# EAGLE schematic Balanbot-v2.0 (EAGLE 6.6.0)
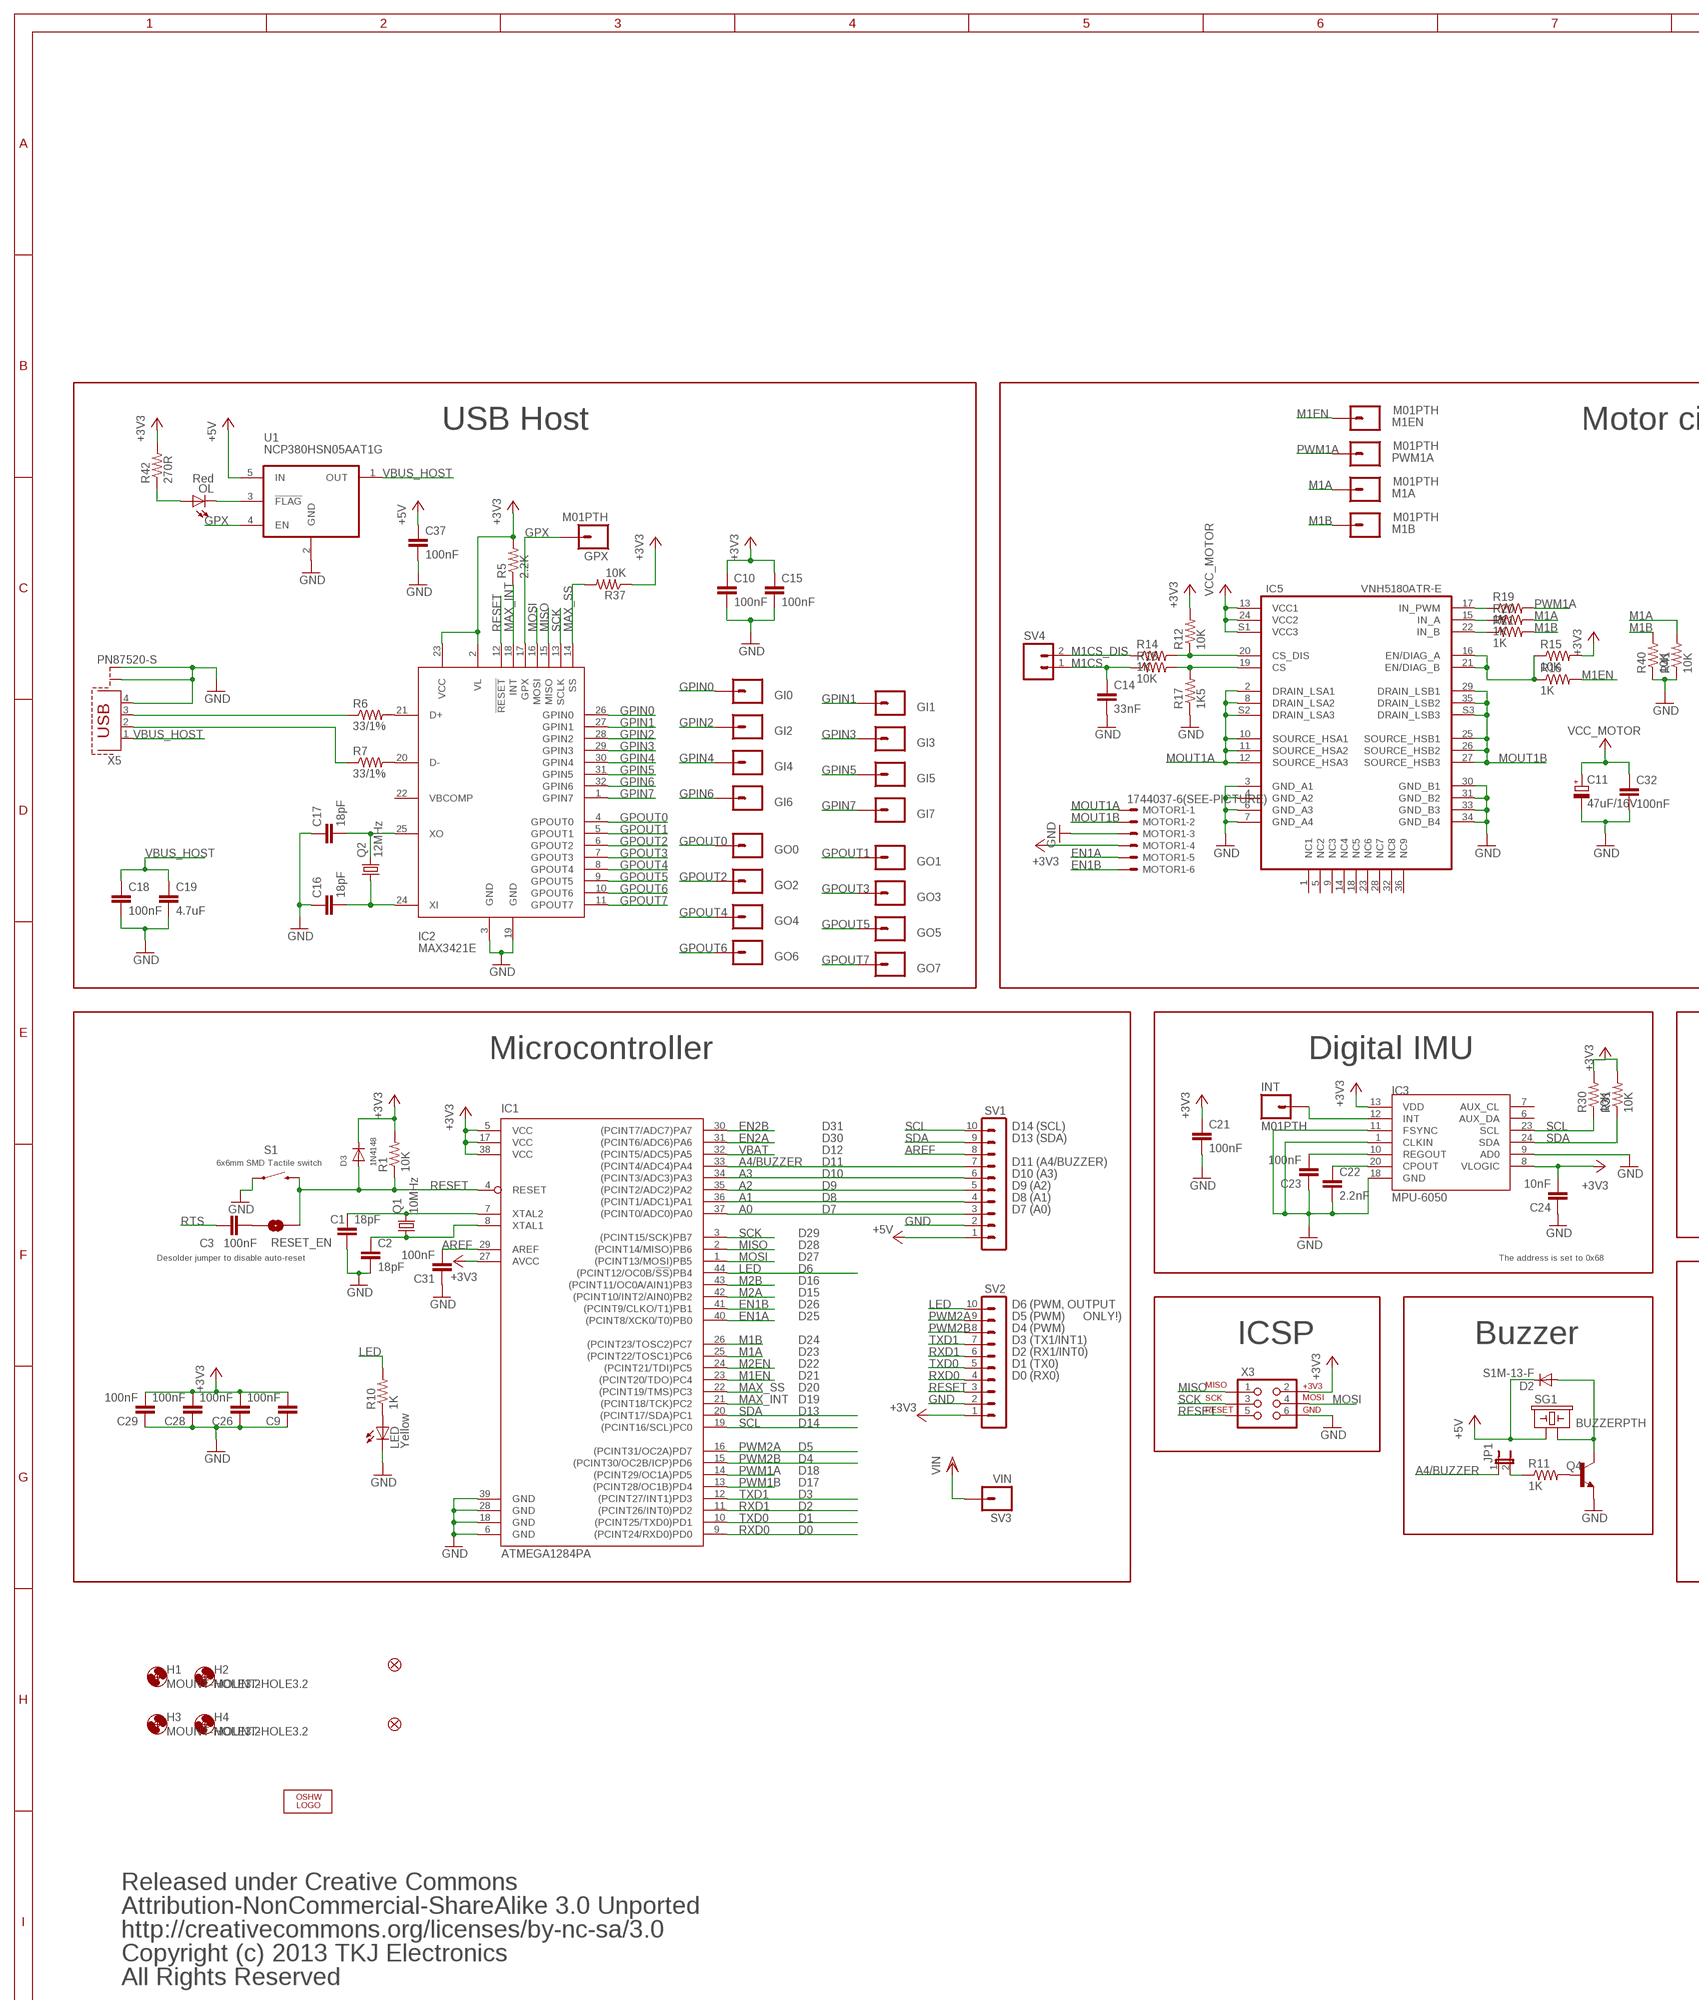
[diagram p0: schematic, sheet 1, part 1 of 2]
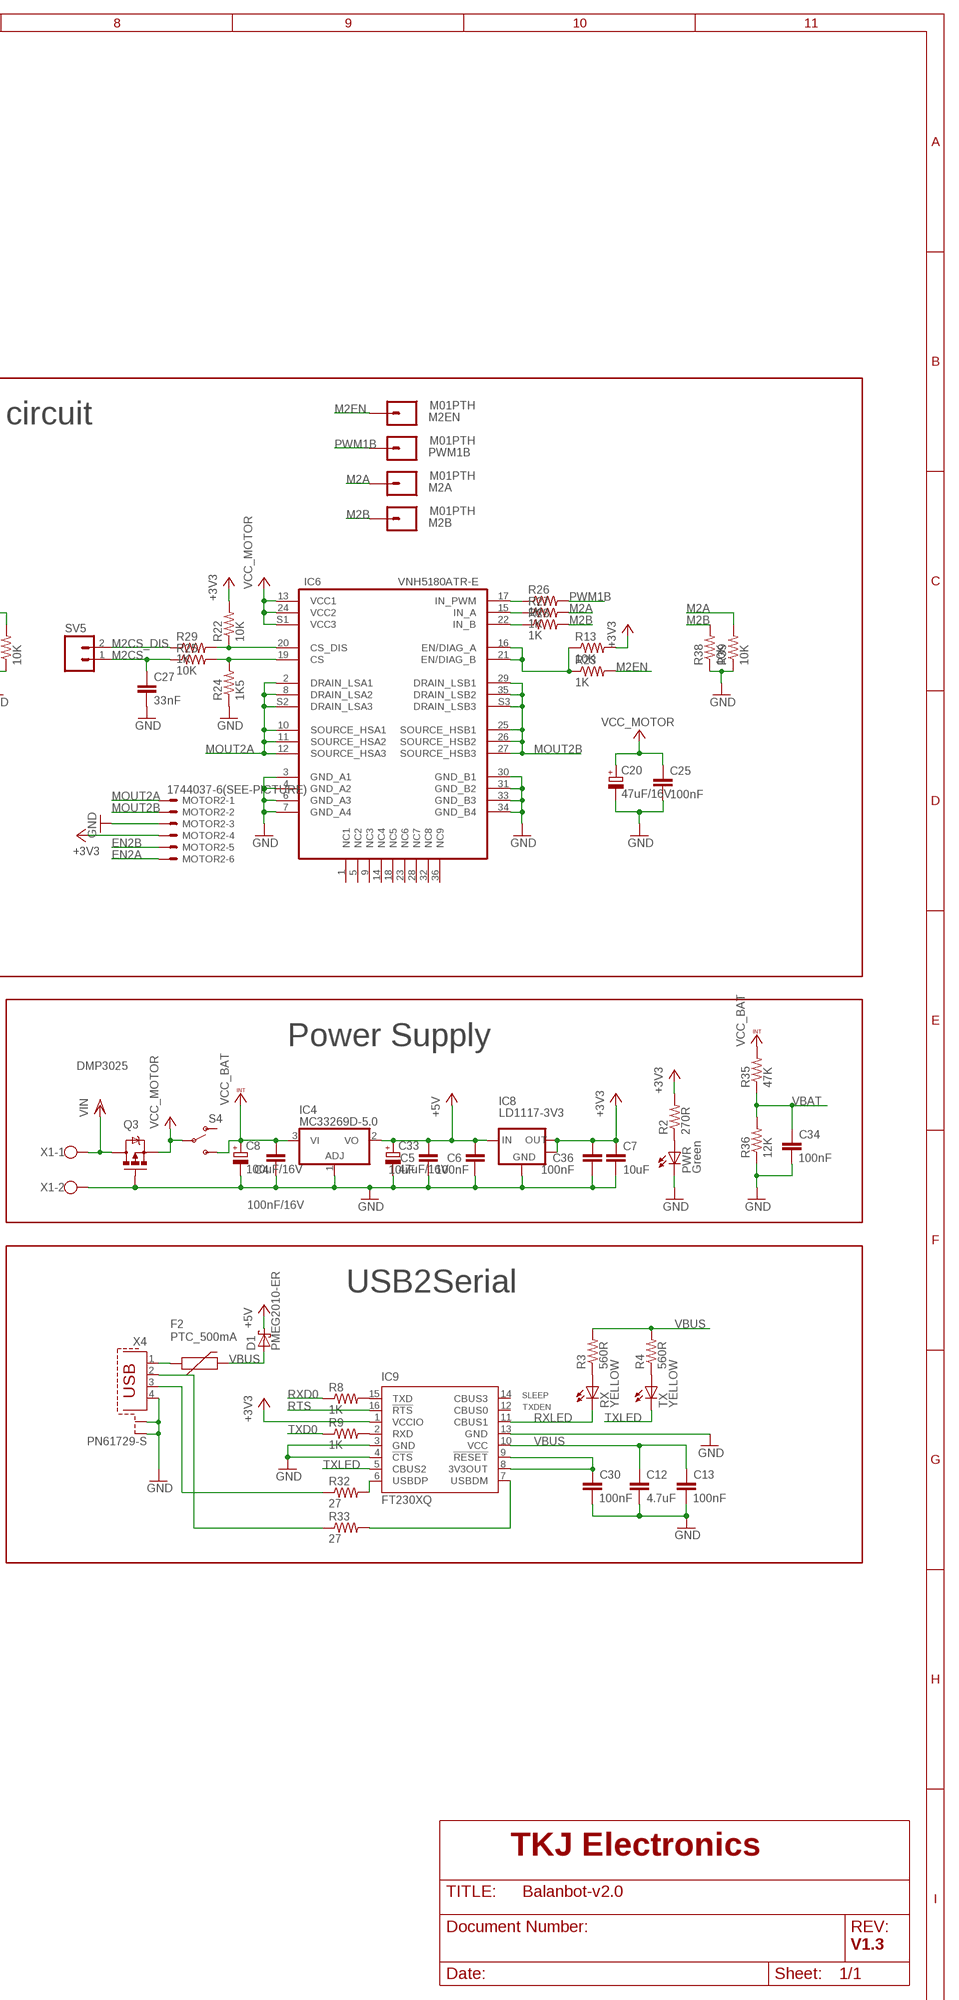
[diagram p1: schematic, sheet 1, part 2 of 2]

## Parts
C1  18pF  C-EUC0603  [C0603]
C2  18pF  C-EUC0603  [C0603]
C3  100nF  C-EUC0603  [C0603]
C4  100nF/16V  C-EUC0603  [C0603]
C5  10uF  C-EUC0805  [C0805]
C6  100nF  C-EUC0603  [C0603]
C7  10uF  C-EUC0805  [C0805]
C8  100uF/16V  CPOL-EUD  [PANASONIC_D]
C9  100nF  C-EUC0603  [C0603]
C10  100nF  C-EUC0603  [C0603]
C11  47uF/16V  CPOL-EUC  [PANASONIC_C]
C12  4.7uF  C-EUC0805  [C0805]
C13  100nF  C-EUC0603  [C0603]
C14  33nF  C-EUC0603  [C0603]
C15  100nF  C-EUC0603  [C0603]
C16  18pF  C-EUC0603  [C0603]
C17  18pF  C-EUC0603  [C0603]
C18  100nF  C-EUC0603  [C0603]
C19  4.7uF  C-EUC0805  [C0805]
C20  47uF/16V  CPOL-EUC  [PANASONIC_C]
C21  100nF  C-EUC0603  [C0603]
C22  2.2nF  C-EUC0603  [C0603]
C23  100nF  C-EUC0603  [C0603]
C24  10nF  C-EUC0603  [C0603]
C25  100nF  C-EUC0603  [C0603]
C26  100nF  C-EUC0603  [C0603]
C27  33nF  C-EUC0603  [C0603]
C28  100nF  C-EUC0603  [C0603]
C29  100nF  C-EUC0603  [C0603]
C30  100nF  C-EUC0603  [C0603]
C31  100nF  C-EUC0603  [C0603]
C32  100nF  C-EUC0603  [C0603]
C33  47uF/16V  CPOL-EUC  [PANASONIC_C]
C34  100nF  C-EUC0603  [C0603]
C36  100nF  C-EUC0603  [C0603]
C37  100nF  C-EUC0603  [C0603]
D1  PMEG2010-ER  [SOD123]
D2  S1M-13-F  [DO214AC]
D3  1N4148  DIODESOD-523  [SOD-523]
F2  PTC_500mA  PTCSMD  [PTC-1206]
GI0  M01PTH  [1X01]
GI1  M01PTH  [1X01]
GI2  M01PTH  [1X01]
GI3  M01PTH  [1X01]
GI4  M01PTH  [1X01]
GI5  M01PTH  [1X01]
GI6  M01PTH  [1X01]
GI7  M01PTH  [1X01]
GO0  M01PTH  [1X01]
GO1  M01PTH  [1X01]
GO2  M01PTH  [1X01]
GO3  M01PTH  [1X01]
GO4  M01PTH  [1X01]
GO5  M01PTH  [1X01]
GO6  M01PTH  [1X01]
GO7  M01PTH  [1X01]
GPX  M01PTH  [1X01]
H1  MOUNT-HOLE3.2  [3,2]
H2  MOUNT-HOLE3.2  [3,2]
H3  MOUNT-HOLE3.2  [3,2]
H4  MOUNT-HOLE3.2  [3,2]
IC1  ATMEGA1284PA  [TQFP44]
IC2  MAX3421E  [TQFP32_8MIL]
IC3  MPU-6050  TESTING_MPU-6050-1  [TESTING_QFN-24-4MM2]
IC4  MC33269D-5.0  MC33269D  [DPACK]
IC5  VNH5180ATR-E  [POWERSSO-36]
IC6  VNH5180ATR-E  [POWERSSO-36]
IC8  LD1117-3V3  LM1117-SOT223  [SOT223]
IC9  FT230XQ  [QFN16]
INT  M01PTH  [1X01]
JP1  JP1E  [JP1]
JP2  FIDUCIALUFIDUCIAL  [MICRO-FIDUCIAL]
JP3  FIDUCIAL1X2  [FIDUCIAL-1X2]
LED  Yellow  LEDCHIPLED_0805  [CHIPLED_0805]
LOGO2  OSHW_LOGO_FILLX0200-NT  [OSHW_FILLX200_NOTEXT]
M1A  M01PTH  [1X01]
M1B  M01PTH  [1X01]
M1EN  M01PTH  [1X01]
M2A  M01PTH  [1X01]
M2B  M01PTH  [1X01]
M2EN  M01PTH  [1X01]
MOTOR1  1744037-6(SEE-PICTURE)  22-23-2061  [22-23-2061]
MOTOR2  1744037-6(SEE-PICTURE)  22-23-2061  [22-23-2061]
OL  Red  LEDCHIPLED_0805  [CHIPLED_0805]
PWM1A  M01PTH  [1X01]
PWM1B  M01PTH  [1X01]
PWR  Green  LEDCHIPLED_0805  [CHIPLED_0805]
Q1  10MHz  CRYSTALHC49UP  [HC49UP]
Q2  12MHz  CRYSTALHC49UP  [HC49UP]
Q3  DMP3025  MOSFET-PCHANNEL  [DPAK]
Q4  TRANSISTOR_NPNSOT23-3  [SOT23-3]
R1  10K  R-US_R0603  [R0603]
R2  270R  R-US_R0603  [R0603]
R3  560R  R-US_R0603  [R0603]
R4  560R  R-US_R0603  [R0603]
R5  2.2K  R-US_R0603  [R0603]
R6  33/1%  R-US_R0603  [R0603]
R7  33/1%  R-US_R0603  [R0603]
R8  1K  R-US_R0603  [R0603]
R9  1K  R-US_R0603  [R0603]
R10  1K  R-US_R0603  [R0603]
R11  1K  R-US_R0603  [R0603]
R12  10K  R-US_R0603  [R0603]
R13  10K  R-US_R0603  [R0603]
R14  1K  R-US_R0603  [R0603]
R15  10K  R-US_R0603  [R0603]
R16  1K  R-US_R0603  [R0603]
R17  1K5  R-US_R0603  [R0603]
R18  10K  R-US_R0603  [R0603]
R19  1K  R-US_R0603  [R0603]
R20  1K  R-US_R0603  [R0603]
R21  1K  R-US_R0603  [R0603]
R22  10K  R-US_R0603  [R0603]
R23  1K  R-US_R0603  [R0603]
R24  1K5  R-US_R0603  [R0603]
R25  10K  R-US_R0603  [R0603]
R26  1K  R-US_R0603  [R0603]
R27  1K  R-US_R0603  [R0603]
R28  1K  R-US_R0603  [R0603]
R29  1K  R-US_R0603  [R0603]
R30  10K  R-US_R0603  [R0603]
R31  10K  R-US_R0603  [R0603]
R32  27  R-US_R0603  [R0603]
R33  27  R-US_R0603  [R0603]
R35  47K  R-US_R0603  [R0603]
R36  12K  R-US_R0603  [R0603]
R37  10K  R-US_R0603  [R0603]
R38  10K  R-US_R0603  [R0603]
R39  10K  R-US_R0603  [R0603]
R40  10K  R-US_R0603  [R0603]
R41  10K  R-US_R0603  [R0603]
R42  270R  R-US_R0603  [R0603]
RESET_EN  SOLDERJUMPERNC  [SJ_2S]
RX  YELLOW  LEDCHIPLED_0805  [CHIPLED_0805]
S1  DTSM-62K-S-V-T/R(SN431)  SWITCH-MOMENTARY-2  [TACTILE_SWITCH_TALL]
S4  SWITCH-SPDTML  [SWITCH-SPDT]
SG1  BUZZERPTH  [BUZZER-12MM]
SV1  MA10-1  [MA10-1]
SV2  MA10-1  [MA10-1]
SV3  VIN  M01PTH  [1X01]
SV4  M02PTH  [1X02]
SV5  M02PTH  [1X02]
TX  YELLOW  LEDCHIPLED_0805  [CHIPLED_0805]
U1  NCP380HSN05AAT1G  POWERSW_FIX-SOT5-1  [SOT23-5]
X1  W237-102  [W237-102]
X3  AVR_SPI_PRG_62X3_LOCK  [2X3_LOCK]
X4  PN61729-S  [PN61729-S]
X5  PN87520-S  [PN87520-S]

## Nets
+3V3: C7.1 C9.2 C10.1 C15.1 C21.1 C24.2 C26.2 C28.2 C29.2 C36.2 D3.K(C) IC1.5(VCC) IC1.17(VCC) IC1.27(AVCC) IC1.38(VCC) IC2.2(VL) IC2.23(VCC) IC3.8(VLOGIC) IC3.13(VDD) IC8.2(OUT) IC8.4(OUT) IC9.1(VCCIO) MOTOR1.4 MOTOR2.4 R1.2 R2.2 R5.2 R12.2 R13.2 R15.2 R22.2 R30.2 R31.2 R37.1 R42.2 SV2.1 X3.2
+5V: C5.1 C6.2 C33.+ C37.1 D1.C D2.C IC4.2(VO) IC8.3(IN) SG1.+ SV1.1 U1.5(IN)
A0: IC1.37((PCINT0/ADC0)PA0) SV1.3
A1: IC1.36((PCINT1/ADC1)PA1) SV1.4
A2: IC1.35((PCINT2/ADC2)PA2) SV1.5
A3: IC1.34((PCINT3/ADC3)PA3) SV1.6
A4/BUZZER: IC1.33((PCINT4/ADC4)PA4) JP1.1 SV1.7
AREF: C31.2 IC1.29(AREF) SV1.8
EN1A: IC1.40((PCINT8/XCK0/T0)PB0) MOTOR1.5
EN1B: IC1.41((PCINT9/CLKO/T1)PB1) MOTOR1.6
EN2A: IC1.31((PCINT6/ADC6)PA6) MOTOR2.6
EN2B: IC1.30((PCINT7/ADC7)PA7) MOTOR2.5
GND: C1.1 C2.2 C4.1 C5.2 C6.1 C7.2 C8.- C9.1 C10.2 C11.- C12.2 C13.1 C14.2 C15.2 C16.1 C17.1 C18.2 C19.2 C20.- C21.2 C22.2 C23.1 C24.1 C25.2 C26.1 C27.2 C28.1 C29.1 C30.1 C31.1 C32.2 C33.- C34.1 C36.1 C37.2 IC1.6(GND) IC1.18(GND) IC1.28(GND) IC1.39(GND) IC2.3(GND) IC2.19(GND) IC3.1(CLKIN) IC3.9(AD0) IC3.11(FSYNC) IC3.18(GND) IC4.1(ADJ) IC5.3(GND_A1) IC5.4(GND_A2) IC5.6(GND_A3) IC5.7(GND_A4) IC5.30(GND_B1) IC5.31(GND_B2) IC5.33(GND_B3) IC5.34(GND_B4) IC6.3(GND_A1) IC6.4(GND_A2) IC6.6(GND_A3) IC6.7(GND_A4) IC6.30(GND_B1) IC6.31(GND_B2) IC6.33(GND_B3) IC6.34(GND_B4) IC8.1(GND) IC9.3(GND) IC9.4(!CTS) IC9.13(GND) LED.C MOTOR1.3 MOTOR2.3 PWR.C Q3.1(G) Q4.2(E) R17.1 R24.1 R36.1 R38.1 R39.1 R40.1 R41.1 S1.A2 SV1.2 SV2.2 U1.2(GND) X1.2 X3.6 X4.4 X4.S1 X4.S2 X5.4 X5.S1 X5.S2
GPIN0: GI0.1 IC2.26(GPIN0)
GPIN1: GI1.1 IC2.27(GPIN1)
GPIN2: GI2.1 IC2.28(GPIN2)
GPIN3: GI3.1 IC2.29(GPIN3)
GPIN4: GI4.1 IC2.30(GPIN4)
GPIN5: GI5.1 IC2.31(GPIN5)
GPIN6: GI6.1 IC2.32(GPIN6)
GPIN7: GI7.1 IC2.1(GPIN7)
GPOUT0: GO0.1 IC2.4(GPOUT0)
GPOUT1: GO1.1 IC2.5(GPOUT1)
GPOUT2: GO2.1 IC2.6(GPOUT2)
GPOUT3: GO3.1 IC2.7(GPOUT3)
GPOUT4: GO4.1 IC2.8(GPOUT4)
GPOUT5: GO5.1 IC2.9(GPOUT5)
GPOUT6: GO6.1 IC2.10(GPOUT6)
GPOUT7: GO7.1 IC2.11(GPOUT7)
GPX: GPX.1 IC2.17(GPX) U1.4(EN)
LED: IC1.44((PCINT12/OC0B/!SS!)PB4) R10.2 SV2.10
M1A: IC1.25((PCINT22/TOSC1)PC6) M1A.1 R20.2 R41.2
M1B: IC1.26((PCINT23/TOSC2)PC7) M1B.1 R21.2 R40.2
M1CS: C14.1 R18.1 SV4.1
M1CS_DIS: R14.1 SV4.2
M1EN: IC1.23((PCINT20/TDO)PC4) M1EN.1 R16.2
M2A: IC1.42((PCINT10/INT2/AIN0)PB2) M2A.1 R27.2 R39.2
M2B: IC1.43((PCINT11/OC0A/AIN1)PB3) M2B.1 R28.2 R38.2
M2CS: C27.1 R25.1 SV5.1
M2CS_DIS: R29.1 SV5.2
M2EN: IC1.24((PCINT21/TDI)PC5) M2EN.1 R23.2
MAX_INT: IC1.21((PCINT18/TCK)PC2) IC2.18(INT) R5.1
MAX_SS: IC1.22((PCINT19/TMS)PC3) IC2.14(SS) R37.2
MISO: IC1.2((PCINT14/MISO)PB6) IC2.15(MISO) X3.1
MOSI: IC1.1((PCINT13/MOSI)PB5) IC2.16(MOSI) X3.4
MOUT1A: IC5.2(DRAIN_LSA1) IC5.8(DRAIN_LSA2) IC5.10(SOURCE_HSA1) IC5.11(SOURCE_HSA2) IC5.12(SOURCE_HSA3) IC5.S2(DRAIN_LSA3) MOTOR1.1
MOUT1B: IC5.25(SOURCE_HSB1) IC5.26(SOURCE_HSB2) IC5.27(SOURCE_HSB3) IC5.29(DRAIN_LSB1) IC5.35(DRAIN_LSB2) IC5.S3(DRAIN_LSB3) MOTOR1.2
MOUT2A: IC6.2(DRAIN_LSA1) IC6.8(DRAIN_LSA2) IC6.10(SOURCE_HSA1) IC6.11(SOURCE_HSA2) IC6.12(SOURCE_HSA3) IC6.S2(DRAIN_LSA3) MOTOR2.1
MOUT2B: IC6.25(SOURCE_HSB1) IC6.26(SOURCE_HSB2) IC6.27(SOURCE_HSB3) IC6.29(DRAIN_LSB1) IC6.35(DRAIN_LSB2) IC6.S3(DRAIN_LSB3) MOTOR2.2
N$1: C3.2 RESET_EN.1
N$2: C2.1 IC1.8(XTAL1) Q1.1
N$3: C1.2 IC1.7(XTAL2) Q1.2
N$4: D2.A Q4.3(C) SG1.-
N$5: JP1.2 R11.1
N$6: R33.1 X4.2
N$7: LED.A R10.1
N$8: OL.A R42.1
N$9: PWR.A R2.1
N$10: R32.1 X4.3
N$11: IC9.7(USBDM) R33.2
N$12: OL.C U1.3(!FLAG)
N$14: IC2.20(D-) R7.2
N$16: IC2.21(D+) R6.2
N$17: R6.1 X5.3
N$18: R7.1 X5.2
N$19: C17.2 IC2.25(XO) Q2.2
N$20: C16.2 IC2.24(XI) Q2.1
N$21: IC3.12(INT) INT.1
N$22: C22.1 IC3.20(CPOUT)
N$23: C23.2 IC3.10(REGOUT)
N$24: IC6.16(EN/DIAG_A) IC6.21(EN/DIAG_B) R13.1 R23.1
N$25: IC6.19(CS) R24.2 R25.2
N$26: IC5.16(EN/DIAG_A) IC5.21(EN/DIAG_B) R15.1 R16.1
N$27: Q4.1(B) R11.2
N$29: IC5.19(CS) R17.2 R18.2
N$30: IC5.20(CS_DIS) R12.1 R14.2
N$31: IC5.22(IN_B) R21.1
N$32: IC5.15(IN_A) R20.1
N$33: IC5.17(IN_PWM) R19.1
N$34: IC6.22(IN_B) R28.1
N$35: IC6.15(IN_A) R27.1
N$36: IC6.17(IN_PWM) R26.1
N$37: IC6.20(CS_DIS) R22.1 R29.2
N$40: F2.1 X4.1
N$41: IC9.15(TXD) R8.2
N$42: IC9.2(RXD) R9.2
N$43: IC9.6(USBDP) R32.2
N$45: C30.2 IC9.8(3V3OUT) IC9.9(!RESET)
N$48: R3.1 RX.A
N$49: R4.1 TX.A
PWM1A: IC1.14((PCINT29/OC1A)PD5) PWM1A.1 R19.2
PWM1B: IC1.13((PCINT28/OC1B)PD4) PWM1B.1 R26.2
PWM2A: IC1.16((PCINT31/OC2A)PD7) SV2.9
PWM2B: IC1.15((PCINT30/OC2B/ICP)PD6) SV2.8
RESET: D3.A IC1.4(RESET) IC2.12(!RESET) R1.1 RESET_EN.2 S1.B2 SV2.3 X3.5
RTS: C3.1 IC9.16(!RTS)
RXD0: IC1.9((PCINT24/RXD0)PD0) R8.1 SV2.4
RXD1: IC1.11((PCINT26/INT0)PD2) SV2.6
RXLED: IC9.11(CBUS1) RX.C
SCK: IC1.3((PCINT15/SCK)PB7) IC2.13(SCLK) X3.3
SCL: IC1.19((PCINT16/SCL)PC0) IC3.23(SCL) R30.1 SV1.10
SDA: IC1.20((PCINT17/SDA)PC1) IC3.24(SDA) R31.1 SV1.9
TXD0: IC1.10((PCINT25/TXD0)PD1) R9.1 SV2.5
TXD1: IC1.12((PCINT27/INT1)PD3) SV2.7
TXLED: IC9.5(CBUS2) TX.C
VBAT: C34.2 IC1.32((PCINT5/ADC5)PA5) R35.1 R36.2
VBUS: C12.1 C13.2 D1.A F2.2 IC9.10(VCC) R3.2 R4.2
VBUS_HOST: C18.1 C19.1 U1.1(OUT) X5.1
VCC: C11.+ C20.+ C25.1 C32.1 IC5.13(VCC1) IC5.24(VCC2) IC5.S1(VCC3) IC6.13(VCC1) IC6.24(VCC2) IC6.S1(VCC3) Q3.3(S) S4.2(P) ; supply symbol labelled VCC_MOTOR
VCC_INT: C4.2 C8.+ IC4.3(VI) R35.2 S4.1(S) ; supply symbol labelled VCC_BAT
VDD: Q3.4(D) SV3.1 X1.1 ; supply symbol labelled VIN
Unconnected: IC2.22(VBCOMP) IC3.6(AUX_DA) IC3.7(AUX_CL) IC5.1(NC1) IC5.5(NC2) IC5.9(NC3) IC5.14(NC4) IC5.18(NC5) IC5.23(NC6) IC5.28(NC7) IC5.32(NC8) IC5.36(NC9) IC6.1(NC1) IC6.5(NC2) IC6.9(NC3) IC6.14(NC4) IC6.18(NC5) IC6.23(NC6) IC6.28(NC7) IC6.32(NC8) IC6.36(NC9) IC9.12(CBUS0) IC9.14(CBUS3) S4.3(O)

## Notes on the sheet
- USB Host | Motor circuit
- Microcontroller | Digital IMU | Power Supply
- D31 | D14 (SCL)
- D30 | D13 (SDA)
- D12
- 6x6mm SMD Tactile switch | D11 | D11 (A4/BUZZER)
- D10 | D10 (A3)
- D9 | D9 (A2)
- D8 | D8 (A1)
- D7 | D7 (A0)
- D29
- D28
- Desolder jumper to disable auto-reset | D27 | The address is set to 0x68
- D6
- D16
- D15
- D26 | D6 (PWM, OUTPUT | USB2Serial
- D25 | D5 (PWM) | ONLY!)
- D4 (PWM)
- D24 | D3 (TX1/INT1) | ICSP | Buzzer
- D23 | D2 (RX1/INT0)
- D22 | D1 (TX0)
- D21 | D0 (RX0)
- D20
- D19
- D13 | SLEEP
- D14 | TXDEN
- D5
- D4
- D18
- D17
- D3
- D2
- D1
- D0
- TKJ Electronics
- Released under Creative Commons
- Attribution-NonCommercial-ShareAlike 3.0 Unported
- http://creativecommons.org/licenses/by-nc-sa/3.0
- Copyright (c) 2013 TKJ Electronics
- V1.3
- All Rights Reserved

## Library data of the parts
C1-C7 C9 C10 C12-C19 C21-C32 C34 C36 C37 = rcl:C-EU: CAPACITOR, European symbol
C8 C11 C20 C33 = rcl:CPOL-EU: POLARIZED CAPACITOR, European symbol
D1 = TKJMixed:PMEG2010-ER: 20V Schottky Diode at 1A - Forward voltage: 340mV @ 1A
D2 = TKJMixed:S1M-13-F: 1000V rectifier, 1A current - Forward voltage: 1.1V @ 1A
D3 = adafruit:DIODE: Diode SMADIODE - SMA Surface Mount Package 20V 1A Schottky Diode Digikey: 641-1014-6-ND DO-1N4148 - Through Hole Small Current Diode SOD-123 20V 1 A (.5mV Vf) Schottky Diode - Digikey: MBRX120TPMSCT-ND SOD-323 10V 570mA (.38mV Vf, 3ns) Schottky Diode - Digikey: ZLLS410CT-ND SOD-523 30V 30mA Schottky Diode (RB751S-40TE61) - Digikey: RB751S-40TE61CT-ND SOT23-R/W - SOT23 Package (R = Solder Paste/Reflow Ovens, W = Hand-Soldering) BAT54Film 40V 300mA - Digikey: 497-7162-1-ND
F2 = SparkFun:PTC: Resettable Fuse PTC Resettable Fuse. Spark Fun Electronics SKU : COM-08357
GI0 GI1-GI7 GO0 GO1-GO7 GPX INT M1A M1B M1EN M2A M2B M2EN PWM1A PWM1B SV3 = SparkFun:M01: Header 1 Standard 1-pin 0.1" header. Use with straight break away headers (SKU : PRT-00116), right angle break away headers (PRT-00553), swiss pins (PRT-00743), machine pins (PRT-00117), and female headers (PRT-00115).
H1-H4 = holes:MOUNT-HOLE: MOUNTING HOLE with drill center marker
IC1 = TKJMixed:ATMEGA1284P: 8-bit Microcontroller with 128K Bytes In-System Programmable Flash Source: http://www.atmel.com/Images/doc8272.pdf Based on ATmega644; MPN: ATMEGA1284P-10AU
IC2 = CH_Maxim:MAX3421E
IC3 = MPU-6050:TESTING_MPU-6050
IC4 = linear:MC33269?*: Adjustable Output Low Dropout Voltage Regulator 800 mA Source: http://www.onsemi.com/pub/Collateral/MC33269-D.PDF
IC5 IC6 = TKJMixed:VNH5180ATR-E
IC8 = TKJMixed:LM1117: Voltage Regulator LM1117 Standard adjustable voltage regulator but in SMD form. Spark Fun Electronics SKU : COM-00595
IC9 = ftdichip:FT230X: USB to BASIC UART IC Auto generated by make-symbol-device-package-bsdl.ulp Rev. 43 Source: Data sheet <http://www.ftdichip.com/Support/Documents/DataSheets/ICs/DS_FT230X.pdf>
JP1 = jumper:JP1E: JUMPER
JP2 JP3 = SparkFun:FIDUCIAL: Fiducial Alignment Points Various fiducial points for machine vision alignment.
LED OL PWR RX TX = led:LED: LED OSRAM: - CHIPLED LG R971, LG N971, LY N971, LG Q971, LY Q971, LO R971, LY R971 LH N974, LH R974 LS Q976, LO Q976, LY Q976 LO Q996 - Hyper CHIPLED LW Q18S LB Q993, LB Q99A, LB R99A - SideLED LS A670, LO A670, LY A670, LG A670, LP A670 LB A673, LV A673, LT A673, LW A673 LH A674 LY A675 LS A676, LA A676, LO A676, LY A676, LW A676 LS A679, LY A679, LG A679 - Hyper Micro SIDELED® LS Y876, LA Y876, LO Y876, LY Y876 LT Y87S - SmartLED LW L88C, LW L88S LB L89C, LB L89S, LG L890 LS L89K, LO L89K, LY L89K LS L896, LA L896, LO L896, LY L896 - TOPLED LS T670, LO T670, LY T670, LG T670, LP T670 LSG T670, LSP T670, LSY T670, LOP T670, LYG T670 LG T671, LOG T671, LSG T671 LB T673, LV T673, LT T673, LW T673 LH T674 LS T676, LA T676, LO T676, LY T676, LB T676, LH T676, LSB T676, LW T676 LB T67C, LV T67C, LT T67C, LS T67K, LO T67K, LY T67K, LW E67C LS E67B, LA E67B, LO E67B, LY E67B, LB E67C, LV E67C, LT E67C LW T67C LS T679, LY T679, LG T679 LS T770, LO T770, LY T770, LG T770, LP T770 LB T773, LV T773, LT T773, LW T773 LH T774 LS E675, LA E675, LY E675, LS T675 LS T776, LA T776, LO T776, LY T776, LB T776 LHGB T686 LT T68C, LB T68C - Hyper Mini TOPLED® LB M676 - Mini TOPLED Santana® LG M470 LS M47K, LO M47K, LY M47K Source: http://www.osram.convergy.de LUXEON: - LUMILED® LXK2-PW12-R00, LXK2-PW12-S00, LXK2-PW14-U00, LXK2-PW14-V00 LXK2-PM12-R00, LXK2-PM12-S00, LXK2-PM14-U00 LXK2-PE12-Q00, LXK2-PE12-R00, LXK2-PE12-S00, LXK2-PE14-T00, LXK2-PE14-U00 LXK2-PB12-K00, LXK2-PB12-L00, LXK2-PB12-M00, LXK2-PB14-N00, LXK2-PB14-P00, LXK2-PB14-Q00 LXK2-PR12-L00, LXK2-PR12-M00, LXK2-PR14-Q00, LXK2-PR14-R00 LXK2-PD12-Q00, LXK2-PD12-R00, LXK2-PD12-S00 LXK2-PH12-R00, LXK2-PH12-S00 LXK2-PL12-P00, LXK2-PL12-Q00, LXK2-PL12-R00 Source: www.luxeon.com KINGBRIGHT: KA-3528ASYC Source: www.kingbright.com
LOGO2 = ohw-logo:OSHW_LOGO_FILL
MOTOR1 MOTOR2 = con-molex:22-23-2061: .100" (2.54mm) Center Header - 6 Pin; MF: MOLEX; MPN: 22-23-2061; OC_FARNELL: 1462922; OC_NEWARK: 27C1933
Q1 Q2 = crystal:CRYSTAL: CRYSTAL; OC_FARNELL: unknown; OC_NEWARK: unknown
Q3 = TKJMixed:MOSFET-PCHANNEL
Q4 = SparkFun:TRANSISTOR_NPN: Transistor NPN BJT configuration in SOT23 package. MMBT2222 is the common NPN we use. Double check BCE configuration again layout.
R1-R33 R35-R42 = rcl:R-US_: RESISTOR, American symbol
RESET_EN = SparkFun:SOLDERJUMPER: Solder Jumper Standard SMD solder jumper. Used to automate production. Two varients : Normally Open and Normally Closed are the same, but have different paste layers. NC will have a large amount of paste and should jumper during reflow.
S1 = SparkFun:SWITCH-MOMENTARY-2
S4 = TKJMixed:SWITCH-SPDT: SWITCH SLIDE MINI SPDT R/A Digikey: http://www.digikey.com/product-detail/en/L102021ML04Q/CKC5102-ND/181454 Datasheet: http://www.ck-components.com/14386/l_4jun13.pdf/; DIGIKEY: CKC5102-ND; NO: L102021ML04Q
SG1 = ModifiedSparkfunBuzzer:BUZZER: Buzzer 12mm Spark Fun Electronics SKU : Comp-Buzzer
SV1 SV2 = TKJMixed:MA10-1: PIN HEADER
SV4 SV5 = SparkFun:M02: Header 2 Standard 2-pin 0.1" header. Use with straight break away headers (SKU : PRT-00116), right angle break away headers (PRT-00553), swiss pins (PRT-00743), machine pins (PRT-00117), and female headers (PRT-00115). Molex polarized connector foot print use with SKU : PRT-08233 with associated crimp pins and housings.
U1 = CH_misc_IC:POWERSW_FIX: USB power switch with fixed current limit. Package variant 1 fits OnSemi NCP380 , TI TPS20xxC, variant 2 fits Micrel MIC20X5, MIC2005A, MAX4789, MAX4791, MAX4793
X1 = con-wago-500:W237-102: WAGO SCREW CLAMP; MPN: 237-102; OC_FARNELL: unknown; OC_NEWARK: 70K9898
X3 = TKJMixed:AVR_SPI_PRG_6: AVR ISP 6 Pin This is the reduced ISP connector for AVR programming. Common on Arduino. This footprint will take up less PCB space and can be used with a 10-pin to 6-pin adapter such as SKU: BOB-08508
X4 = con-berg:PN61729-S: BERG USB connector; OC_FARNELL: unknown; OC_NEWARK: unknown
X5 = con-berg:PN87520-S; OC_FARNELL: unknown; OC_NEWARK: unknown